# Altium project Motor Controller.PrjPcb
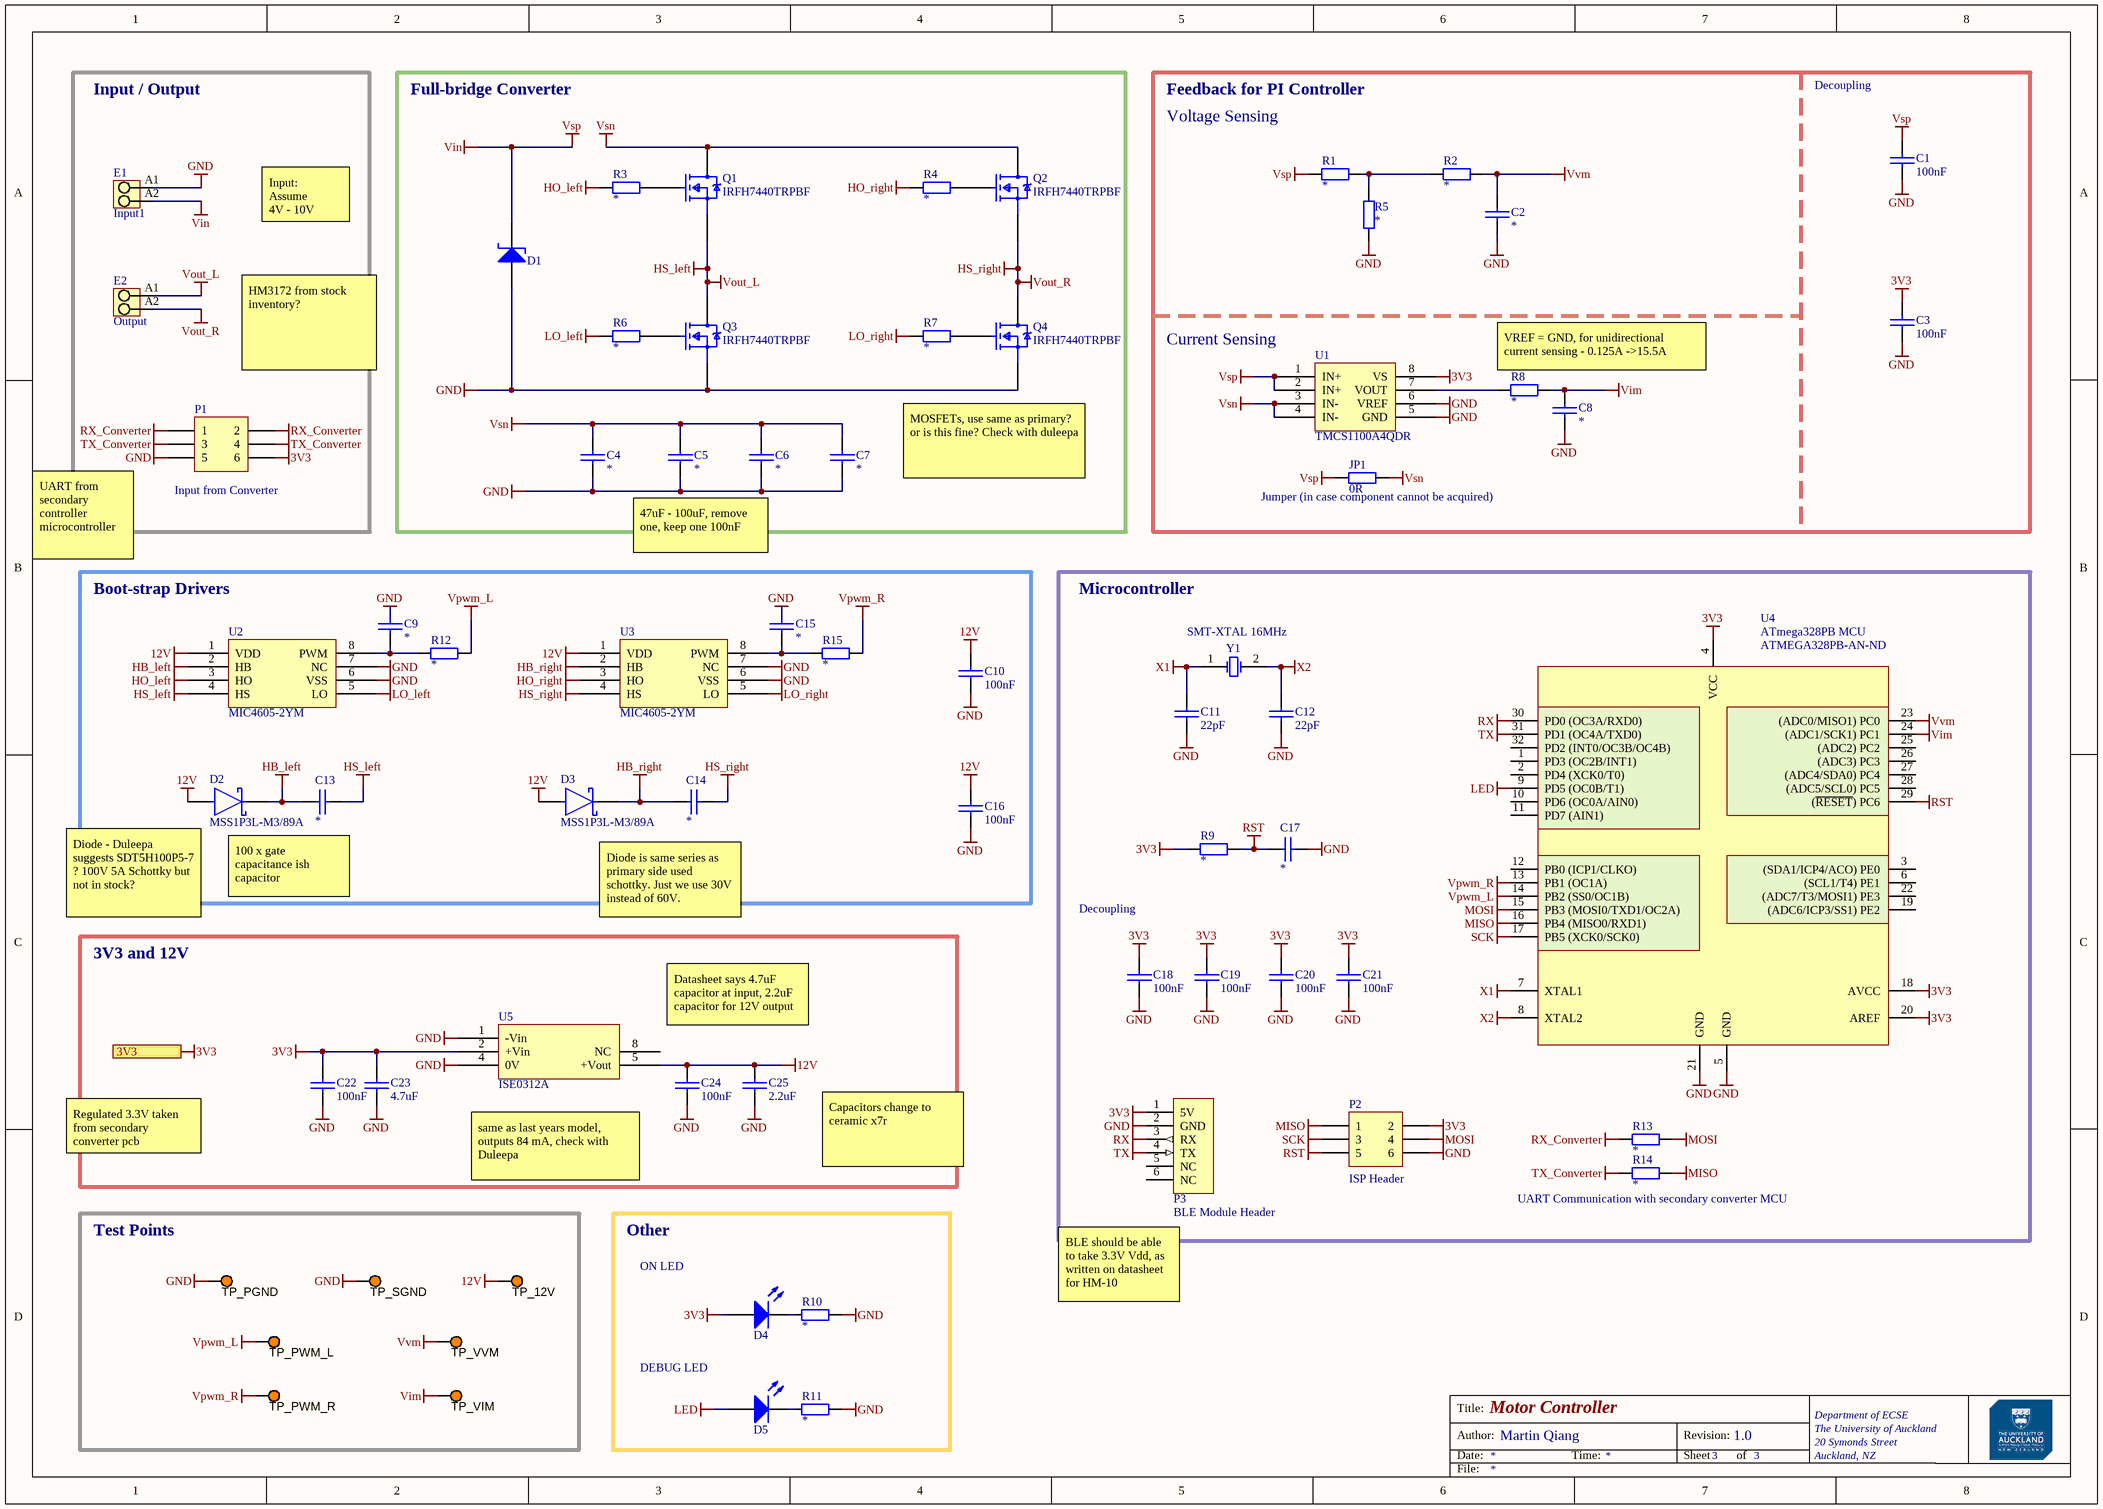
[diagram p0: MotorControllerV2.SchDoc]
1 sheet, 68 parts. Net scope: flat (ports and power ports of the same name join across sheets).
Board file: MotorControllerV1.PcbDoc

## Sheet MotorControllerV2.SchDoc: Motor Controller
size A3; Author: Martin Qiang; Address1: Department of ECSE; Address2: The University of Auckland; Address3: 20 Symonds Street; Address4: Auckland, NZ; Revision: 1.0; SheetNumber: 3; SheetTotal: 3

### Parts
C1  100nF  [0805 CAP]
C2  *  [0805 CAP]
C3  100nF  [0805 CAP]
C4  *  [0805 CAP]
C5  *  [0805 CAP]
C6  *  [0805 CAP]
C7  *  [0805 CAP]
C8  *  [0805 CAP]
C9  *  [0805 CAP]
C10  100nF  [0805 CAP]
C11  22pF  [0805 CAP]
C12  22pF  [0805 CAP]
C13  *  [0805 CAP]
C14  *  [0805 CAP]
C15  *  [0805 CAP]
C16  100nF  [0805 CAP]
C17  *  [0805 CAP]
C18  100nF  [0805 CAP]
C19  100nF  [0805 CAP]
C20  100nF  [0805 CAP]
C21  100nF  [0805 CAP]
C22  100nF  [0805 CAP]
C23  4.7uF  [0805 CAP]
C24  100nF  [0805 CAP]
C25  2.2uF  [0805 CAP]
D1  BZT52H-B4V7  [SOD123]  (value not drawn)
D2  MSS1P3L-M3/89A  [FP-96591-MFG]
D3  MSS1P3L-M3/89A  [FP-96591-MFG]
D4  LTST-C170KGKT  [0805 LED]  (value not drawn)
D5  LTST-C170KGKT  [0805 LED]  (value not drawn)
E1  Input1  [PM_5_08_90_02]
E2  Output  [PM_5_08_90_02]
JP1  0R  [Axial 0.1]
P1  Input from Converter  [HDR2X3]
P2  ISP Header  [HDR2X3]
P3  BLE Module Header  [HM10_HDR1X6]
Q1  IRFH7440TRPBF  [Infineon_PG-TDSON-8_MFG]
Q2  IRFH7440TRPBF  [Infineon_PG-TDSON-8_MFG]
Q3  IRFH7440TRPBF  [Infineon_PG-TDSON-8_MFG]
Q4  IRFH7440TRPBF  [Infineon_PG-TDSON-8_MFG]
R1  *  [0805 RES]
R2  *  [0805 RES]
R3  *  [0805 RES]
R4  *  [0805 RES]
R5  *  [0805 RES]
R6  *  [0805 RES]
R7  *  [0805 RES]
R8  *  [0805 RES]
R9  *  [0805 RES]
R10  *  [0805 RES]
R11  *  [0805 RES]
R12  *  [0805 RES]
R13  *  [0805 RES]
R14  *  [0805 RES]
R15  *  [0805 RES]
TP_12V  5003  [TP_TH]  (value not drawn)
TP_PGND  5003  [TP_TH]  (value not drawn)
TP_PWM_L  5003  [TP_TH]  (value not drawn)
TP_PWM_R  5003  [TP_TH]  (value not drawn)
TP_SGND  5003  [TP_TH]  (value not drawn)
TP_VIM  5003  [TP_TH]  (value not drawn)
TP_VVM  5003  [TP_TH]  (value not drawn)
U1  TMCS1100A4QDR  [SOIC8_D_TEX]
U2  MIC4605-2YM  [MIC4605-2YM]
U3  MIC4605-2YM  [MIC4605-2YM]
U4  ATmega328PB MCU  Supplier Part Number 1: ATMEGA328PB-AN-ND  [32 - TQFP]
U5  ISE0312A  [ISE0312A]
Y1  SMT-XTAL 16MHz  [HC49-US]

### Blocks framed on the sheet
Input / Output: E1 E2 P1
Full-bridge Converter: C4-C7 D1 Q1-Q4 R3 R4 R6 R7
Boot-strap Drivers: C9 C10 C13-C16 D2 D3 R12 R15 U2 U3
Microcontroller: C11 C12 C17-C21 P2 P3 R9 R13 R14 U4 Y1
3V3 and 12V: C22-C25 U5
Test Points: TP_12V TP_PGND TP_PWM_L TP_PWM_R TP_SGND TP_VIM TP_VVM
Other: D4 D5 R10 R11

### Ports
3V3 (in)

### Nets
3V3: C3.1 C18.1 C19.1 C20.1 C21.1 C22.1 C23.1 D4.1(A) P1.6 P2.2 P3.1(5V) R9.2 U1.8(VS) U4.4(VCC) U4.18(AVCC) U4.20(AREF) U5.2(+Vin) ; port 3V3
12V: C10.2 C16.2 C24.1 C25.1 D2.2(A) D3.2(A) TP_12V.1 U2.1(VDD) U3.1(VDD) U5.5(+Vout)
GND: C1.2 C2.2 C3.2 C4.1 C5.1 C6.1 C7.1 C8.2 C9.1 C10.1 C11.2 C12.2 C15.1 C16.1 C17.2 C18.2 C19.2 C20.2 C21.2 C22.2 C23.2 C24.2 C25.2 D1.1(A) E1.A1 P1.5 P2.6 P3.2(GND) Q3.1,2,3(S) Q4.1,2,3(S) R5.2 R10.1 R11.1 TP_PGND.1 TP_SGND.1 U1.5(GND) U1.6(VREF) U2.6(VSS) U2.7(NC) U3.6(VSS) U3.7(NC) U4.5(GND) U4.21(GND) U5.1(-Vin) U5.4(0V)
HB_left: C13.1 D2.1(C) U2.2(HB)
HB_right: C14.1 D3.1(C) U3.2(HB)
HO_left: R3.1 U2.3(HO)
HO_right: R4.1 U3.3(HO)
HS_left: C13.2 E2.A1 Q1.1,2,3(S) Q3.5,6,7,8(D) U2.4(HS)  [also labelled Vout_L]
HS_right: C14.2 E2.A2 Q2.1,2,3(S) Q4.5,6,7,8(D) U3.4(HS)  [also labelled Vout_R]
LED: D5.1(A) U4.9(PD5_(OC0B/T1))
LO_left: R6.2 U2.5(LO)
LO_right: R7.1 U3.5(LO)
MISO: P2.1 R14.1 U4.16(PB4_(MISO0/RXD1))
MOSI: P2.4 R13.1 U4.15(PB3_(MOSI0/TXD1/OC2A))
RST: C17.1 P2.5 R9.1 U4.29((~{RESET})_PC6)
RX: P3.3(RX) U4.30(PD0_(OC3A/RXD0))
RX_Converter: P1.1 P1.2 R13.2
SCK: P2.3 U4.17(PB5_(XCK0/SCK0))
TX: P3.4(TX) U4.31(PD1_(OC4A/TXD0))
TX_Converter: P1.3 P1.4 R14.2
Vim: C8.1 R8.2 TP_VIM.1 U4.24((ADC1/SCK1)_PC1)
Vin: C1.1 D1.2(K) E1.A2 JP1.1 R1.2 U1.1(IN+) U1.2(IN+)  [also labelled Vsp]
Vpwm_L: R12.2 TP_PWM_L.1 U4.14(PB2_(SS0/OC1B))
Vpwm_R: R15.2 TP_PWM_R.1 U4.13(PB1_(OC1A))
Vsn: C4.2 C5.2 C6.2 C7.2 JP1.2 Q1.5,6,7,8(D) Q2.5,6,7,8(D) U1.3(IN-) U1.4(IN-)
Vvm: C2.1 R2.2 TP_VVM.1 U4.23((ADC0/MISO1)_PC0)
X1: C11.1 U4.7(XTAL1) Y1.1(OSC1)
X2: C12.1 U4.8(XTAL2) Y1.2(OSC2)
NetC9_2: C9.2 R12.1 U2.8(PWM)
NetC15_2: C15.2 R15.1 U3.8(PWM)
NetD4_2: D4.2(K) R10.2
NetD5_2: D5.2(K) R11.2
NetQ1_4: Q1.4(G) R3.2
NetQ2_4: Q2.4(G) R4.2
NetQ3_4: Q3.4(G) R6.1
NetQ4_4: Q4.4(G) R7.2
NetR1_1: R1.1 R2.1 R5.1
NetR8_1: R8.1 U1.7(VOUT)

Not connected (* = marked no-connect by the designer): P3 5(NC) 6(NC); U4 1(PD3_(OC2B/INT1)) 2(PD4_(XCK0/T0)) 3((SDA1/ICP4/ACO)_PE0) 6((SCL1/T4)_PE1) 10(PD6_(OC0A/AIN0)) 11(PD7_(AIN1)) 12(PB0_(ICP1/CLKO)) 19((ADC6/ICP3/SS1)_PE2) 22((ADC7/T3/MOSI1)_PE3) 25((ADC2)_PC2) 26((ADC3)_PC3) 27((ADC4/SDA0)_PC4) 28((ADC5/SCL0)_PC5) 32(PD2_(INT0/OC3B/OC4B)); U5 8(NC)

### Notes on the sheet
- Feedback for PI Controller
- Decoupling
- Voltage Sensing
- Input:
  Assume
  4V - 10V
- HM3172 from stock inventory?
- (near U1) Current Sensing
- VREF = GND, for unidirectional current sensing - 0.125A ->15.5A
- MOSFETs, use same as primary? or is this fine? Check with duleepa
- (near JP1) Jumper (in case component cannot be acquired)
- UART from secondary controller microcontroller
- 47uF - 100uF, remove one, keep one 100nF
- (near D2) Diode - Duleepa suggests SDT5H100P5-7 ? 100V 5A Schottky but not in stock?
- 100 x gate capacitance ish capacitor
- Diode is same series as primary side used schottky. Just we use 30V instead of 60V.
- Datasheet says 4.7uF capacitor at input, 2.2uF capacitor for 12V output
- Regulated 3.3V taken from secondary converter pcb
- same as last years model, outputs 84 mA, check with Duleepa
- Capacitors change to ceramic x7r
- (near R14) UART Communication with secondary converter MCU
- ON LED
- (near P3) BLE should be able to take 3.3V Vdd, as written on datasheet for HM-10
- DEBUG LED
- Title:
- Author:
- Date:
- Time:
- Revision:
- Sheet
- of
- File:

### Library data of the parts
C1-C22 C24 = CerCap_SMT_0805: SMT ceramic capacitor 0805 size; Value: *
C23 = CerCap_SMT_0805: SMT ceramic capacitor 0805 size / x7r 4.7uF; Value: *
C25 = CerCap_SMT_0805: SMT ceramic capacitor 0805 size / x7r, 2.2uF; Value: *
D1 = Zener_SMT_SOD123: SMT zener diode with SOD123 package; Manufacturer: Nexperia USA Inc.; Manufacturer Part Number: BZT52H-B4V7,115; Tolerance: ±2%; Supplier 1: Digi-Key; RoHS: RoHS Compliant; Category: Discrete Semiconductor Products; Stock 1: 0; Pricing 1: 1=0.51, 10=0.408, 100=0.2164, 500=0.14232, 1000=0.09678 (NZD); Packaging: Cut Tape (CT); Part Status: Active; Operating Temperature: -65°C ~ 150°C (TA); Mounting Type: Surface Mount; Package / Case: SOD-123F; Supplier Device Package: SOD-123F; ComponentLink1URL: https://assets.nexperia.com/documents/data-sheet/BZT52H_SER.pdf; ComponentLink1Description: https://assets.nexperia.com/documents/data-sheet/BZT52H_SER.pdf; Supplier Part Number 1: 1727-1611-1-ND
D2 D3 = Diode_Schottky: DIODE SCHOTTKY 30V 1A MICROSMP / Rectifier Diode Schottky 30V 1A 2-Pin Micro SMP T/R; Manufacturer: Vishay; Max Junction Temp: +150°C; Max Surge Forward Current: 25A; Value: 65pF; Peak Reverse Current: 15uA; Forward Voltage: 500mV; Max Reverse Current: 250uA; Element Configuration: Single; Max Repetitive Reverse Voltage: 30V; Mouser Description: Schottky Diodes & Rectifiers 1.0 Amp 30 Volt; Device Class L2: Diodes; RoHS: TRUE; Temperature Range Low: -55°C; ComponentLink2URL: http://www.vishay.com/docs/89020/mss1p3l.pdf; Octopart: https://octopart.com/mss1p3l-m3%2F89a-vishay-42670898; Automotive: No; Height: 0.73mm; Temperature: -55°C to +150°C; Temperature Range High: +150°C; ComponentLink2Description: Datasheet; Lead Free: Yes; Digikey Description: DIODE SCHOTTKY 30V 1A MICROSMP; Forward Current: 1A; Manufacturer Part Number: MSS1P3L-M3/89A; Footprint Url: http://www.vishay.com/docs/96591/microsmp_do-219ad_fredpt.pdf; Device Class L1: Discrete Semiconductors; Capacitance: 65pF; Device Class L3: Schottky Diodes; Package: 96591; Category: Diode; Supplier 1: Digi-Key; Stock 1: 2503; Pricing 1: 1=0.30000, 10=0.24800, 100=0.13170, 500=0.08662, 1000=0.05890, 2000=0.05313 (USD); Mount: Surface Mount; Number of Pins: 2; Min Operating Temperature: -55°C; Max Operating Temperature: 150°C; Packaging: Tape and Reel; Max Surge Current: 25A; Package Quantity: 1; Average Rectified Current: 1A; Max Reverse Leakage Current: 250uA; Peak Non-Repetitive Surge Current: 25A; Max Repetitive Reverse Voltage (Vrrm): 30V; Max Forward Surge Current (Ifsm): 25A; Max Reverse Voltage (DC): 30V; Series: eSMP®; Length: 0.09inch; Width: 0.055inch; Radiation Hardening: No; REACH SVHC: Unknown; RoHS Compliant: Yes; ComponentLink1URL: https://datasheet.ciiva.com/23642/mss1p3l-23642464.pdf?src-supplier=Newark; ComponentLink1Description: https://datasheet.ciiva.com/23642/mss1p3l-23642464.pdf?src-supplier=Newark; ComponentLink3URL: https://datasheet.ciiva.com/917/mss1p3l-917251.pdf?src-supplier=Digi-Key; ComponentLink3Description: https://datasheet.ciiva.com/917/mss1p3l-917251.pdf?src-supplier=Digi-Key; ComponentLink4URL: https://datasheet.ciiva.com/917/mss1p3l-917252.pdf?src-supplier=Digi-Key; ComponentLink4Description: https://datasheet.ciiva.com/917/mss1p3l-917252.pdf?src-supplier=Digi-Key; ComponentLink5URL: https://datasheet.ciiva.com/917/mss1p3l-917253.pdf?src-supplier=Digi-Key; ComponentLink5Description: https://datasheet.ciiva.com/917/mss1p3l-917253.pdf?src-supplier=Digi-Key; ComponentLink6URL: https://datasheet.ciiva.com/8290/mss1p3l-8290391.pdf?src-supplier=Avnet; ComponentLink6Description: https://datasheet.ciiva.com/8290/mss1p3l-8290391.pdf?src-supplier=Avnet; ComponentLink7URL: https://datasheet.ciiva.com/16464/mss1p3l-16464118.pdf?src-supplier=Future+Electronics; ComponentLink7Description: https://datasheet.ciiva.com/16464/mss1p3l-16464118.pdf?src-supplier=Future+Electronics; ComponentLink8URL: https://datasheet.ciiva.com/7962/mss1p3l-7962344.pdf?src-supplier=Element14; ComponentLink8Description: https://datasheet.ciiva.com/7962/mss1p3l-7962344.pdf?src-supplier=Element14; ComponentLink9URL: https://datasheet.ciiva.com/25934/mss1p3l-25934805.pdf?src-supplier=Avnet+Europe; ComponentLink9Description: https://datasheet.ciiva.com/25934/mss1p3l-25934805.pdf?src-supplier=Avnet+Europe
D4 D5 = LED_SMT_0805: SMT LED 0805 size; Manufacturer: Lite-On Inc.; Color: Green; Lens Color: Colorless; Lens Transparency: Clear; Millicandela Rating: 35mcd; Lens Style/Size: Rectangle with Flat Top, 1.40mm x 1.25mm; Voltage - Forward (Vf) (Typ): 2V; Current - Test: 20mA; Viewing Angle: 130°; Wavelength - Dominant: 571nm; Wavelength - Peak: 574nm; Supplier 1: Digi-Key; Manufacturer Part Number: LTST-C170KGKT; RoHS: RoHS Compliant; Category: Optoelectronics; Stock 1: 503069; Pricing 1: 1=0.62, 10=0.459, 25=0.338, 100=0.2415, 250=0.16416, 500=0.14486, 1000=0.11347 (NZD); Packaging: Cut Tape (CT); Part Status: Active; Mounting Type: Surface Mount; Features: -; Package / Case: 0805 (2012 Metric); Size / Dimension: 2.00mm L x 1.25mm W; Height (Max): 1.10mm; ComponentLink1URL: http://optoelectronics.liteon.com/upload/download/DS22-2000-073/LTST-C170KGKT.pdf; ComponentLink1Description: http://optoelectronics.liteon.com/upload/download/DS22-2000-073/LTST-C170KGKT.pdf; Supplier Part Number 1: 160-1414-1-ND
E1 E2 = 2WayScrewTerminal_5.08mm: Conn Terminal Block 2 POS 5.08mm Solder ST Thru-Hole 15A Box; Manufacturer: Weidmueller; PartNumber: 1760490000; Contact_surface: tinned; Pitch_mm: 5,08 mm; Solid_min_H05_07_V_U: 0,13 mm²; Wire_cross_section_AWG_min_UL_1059: AWG 26; Wire_cross_section_AWG_max_UL_1059: AWG 14; Rated_voltage_for_surge_voltage_class_pollution_degree_II_2: 600 V; Mounting_onto_the_PCB: Solder connection; Solder_pin_length_mm: 3,5 mm; Side_termination_characteristic: closed side; Contact_material: Cu-Leg; Pitch_inch: 0,2 inch; No_of_poles: 2; UL_94_flammability_rating: V-0; Insulating_material: Wemid (PA); Rated_voltage_use_group_B_UL_1059: 300 V; Solid_max_H05_07_V_U: 2,5 mm²; Short_text_for_material: PM 5.08/02/90 3.5SN OR BX; Voltage Rating: 300V; Current Rating: 10A; Number of Levels: 1; Max Current Rating: 16A; Connector Type: PCB,Terminal Block; Pitch: 508mm; Wire Gauge (Max): 26AWG; Wire Gauge (Min): 14AWG; Hole Diameter: 1.3mm; Stripping Length: 6mm; Wire/Cable Gauge: 24AWG; Approvals: CSA,cURus; Revision: V1; Qty: 500 PCS; ComponentLink2Description: URL Link1; Packaging: Box; Rated_current_use_group_B_UL_1059: 15 A; PackageReference: PM_5_08_90_02; ComponentLink2URL: http://catalog.weidmueller.com/catalog/Start.do?localeId=en&ObjectID=1760490000; Colour: Orange; ComponentLink1Description: Manufacturer URL; ComponentLink1URL: http://www.weidmueller.com/; Supplier 1: Digi-Key; Manufacturer Part Number: 1760490000; RoHS: Yes; Category: Terminal Blocks; Stock 1: 2610; Pricing 1: 1=1.00000, 10=0.70300, 25=0.65560, 50=0.59500, 100=0.59230, 250=0.50016, 500=0.47384, 1000=0.42120, 5000=0.38025 (USD); Mount: Through Hole; Color: Orange; Contact Material: Copper Alloy; Housing Material: Thermoplastic; Contact Plating: Tin; Housing Color: Orange; Min Operating Temperature: -50°C; Max Operating Temperature: 120°C; Number of Poles: 2; Package Quantity: 500; Number of Rows: 1; Number of Positions Per Level: 2; Current: 15A; Voltage: 300V; Termination: Solder; Number of Contacts: 2; Number of Circuits: 2; Orientation: Straight; Series: PM; Number of Positions: 2; Max Supply Voltage: 300V; Length: 11.16mm; Width: 8mm; Depth: 8mm; Radiation Hardening: No; Flammability Rating: UL94 V-0; Lead Free: Lead Free; REACH SVHC: No SVHC; ComponentLink3URL: https://datasheet.ciiva.com/823/1760490000-823936.pdf?src-supplier=Digi-Key; ComponentLink3Description: https://datasheet.ciiva.com/823/1760490000-823936.pdf?src-supplier=Digi-Key; ComponentLink4URL: https://datasheet.ciiva.com/16046/1760490000-pm-5-08-02-90-3-5sn-or-bx-en-pdf-148-16046417.pdf?src-supplier=Onlinecomponents.com; ComponentLink4Description: https://datasheet.ciiva.com/16046/1760490000-pm-5-08-02-90-3-5sn-or-bx-en-pdf-148-16046417.pdf?src-supplier=Onlinecomponents.com
JP1 = Jumper
P1 P2 = Header 3X2: Header, 3-Pin, Dual row; LatestRevisionDate: 17-Jul-2002; LatestRevisionNote: Re-released for DXP Platform.; Publisher: Altium Limited
P3 = BLEModule_TH: 2.54mm pitch 6-pin header for BLE module; LatestRevisionDate: 17-Jul-2002; LatestRevisionNote: Re-released for DXP Platform.; Publisher: Altium Limited
Q1-Q4 = IRFH7440TRPBF: Single N-Channel 40 V 2.4 mOhm 92 nC HEXFET® Power Mosfet - PQFN 5 x 6 mm; Manufacturer: International Rectifier; Continuous Drain Current (ID): 85A; Rise Time: 45ns; Input Capacitance: 4.574nF; Max Power Dissipation: 104W; Rds On Max: 2.4mR; Fall Time: 42ns; Turn-Off Delay Time: 53ns; Drain to Source Voltage (Vdss): 40V; Turn-On Delay Time: 12ns; Threshold Voltage: 2.2V; Gate to Source Voltage (Vgs): 20V; Number of Elements: 1; Supplier 1: Newark; Manufacturer Part Number: IRFH7440TRPBF; RoHS: Yes; Category: MOSFETs; Mount: Surface Mount; Case/Package: QFN EP; Number of Pins: 8; Min Operating Temperature: -55°C; Max Operating Temperature: 150°C; Packaging: Tape and Reel; Package Quantity: 4000; Drain to Source Breakdown Voltage: 40V; Drain to Source Resistance: 2.4mR; Power Dissipation: 104W; On-State Resistance: 2.4MR; Series: StrongIRFET™; Drain-source On Resistance-Max: 2.4MR; Length: 5.85mm; Width: 5mm; Height: 1.17mm; Radiation Hardening: No; REACH SVHC: No SVHC; Lead Free: Lead Free; RoHS Compliant: Yes; ComponentLink1URL: https://datasheet.ciiva.com/30480/0900766b811ccaf7-30480025.pdf?src-supplier=RSComponents; ComponentLink1Description: https://datasheet.ciiva.com/30480/0900766b811ccaf7-30480025.pdf?src-supplier=RSComponents; ComponentLink2URL: https://datasheet.ciiva.com/16390/irfh7440pbf-16390391.pdf?src-supplier=Future+Electronics; ComponentLink2Description: https://datasheet.ciiva.com/16390/irfh7440pbf-16390391.pdf?src-supplier=Future+Electronics; ComponentLink3URL: https://datasheet.ciiva.com/6371/irfh7440pbf-6371293.pdf?src-supplier=Digi-Key; ComponentLink3Description: https://datasheet.ciiva.com/6371/irfh7440pbf-6371293.pdf?src-supplier=Digi-Key
R1-R15 = Res_SMT_0805: 0805 resistor; Published: 8-Jun-2000; LatestRevisionDate: 17-Jul-2002; LatestRevisionNote: Re-released for DXP Platform.; PackageReference: AXIAL-0.4; Publisher: Altium Limited; Value: *; ComponentLink1Description: https://nz.mouser.com/datasheet/2/315/AOA0000C304-1149620.pdf
TP_12V TP_PGND TP_PWM_L TP_PWM_R TP_SGND TP_VIM TP_VVM = TestPoint: Test Point, Orange, 1-Pin THD, RoHS; Peak Reverse Current: 600 uA; Forward Current: 3 A; Max Surge Current: 80 A; Forward Voltage: 1.08 V; Max Operating Temperature: 150 degC; PackageReference: 5003; Pins: 2; ComponentLink2URL: http://keyelco.com/userAssets/file/M65p56.pdf; PackageDescription: 1-Pin Through Hole Device, Dia 2.54 mm; Weight: 0.01 lb; Diameter: 5.3 mm; Mount: Through Hole; Package Quantity: 500; Packaging: Bulk; Min Operating Temperature: -65 degC; ComponentLink1Description: Manufacturer URL; Height: 0.25 inch; ComponentLink1URL: http://www.keyelco.com/; ComponentLink2Description: Datasheet; Width: 0.25 inch; REACH SVHC: No SVHC; RoHSCompliant: true; Radiation Hardening: No; Length: 9.5 mm; DatasheetVersion: Jun-15
U1 = TMCS1100A4QDR: Precision isolated current sensor with external reference 8-SOIC -40 to 125; Manufacturer: Texas Instruments; Supplier 1: Digi-Key; Manufacturer Part Number: TMCS1100A4QDR; RoHS: Yes; Category: Integrated Circuits (ICs); Stock 1: 2103; Pricing 1: 1=4.42000, 10=3.97300, 25=3.75640, 100=3.25550, 250=3.08856, 500=2.77136, 1000=2.75625 (USD)
U2 U3 = MIC4605-2YM: Driver 1A 2-OUT High and Low Side Half Brdg Non-Inv 8-Pin SOIC N Tube; Manufacturer: Microchip; Manufacturer Part Number: MIC4605-2YM-T5; Number of Drivers: 2; Max Supply Voltage: 16V; Min Supply Voltage: 5.5V; Number of Outputs: 1; Rise Time: 20ns; Nominal Supply Current: 135uA; Output Voltage: 1.9V; Element Configuration: Single; Propagation Delay: 35ns; Channel Type: Independent; Supplier 1: Digi-Key; RoHS: Yes; Category: Gate Drivers; Pricing 1: 1=1.39000 (USD); Mount: Surface Mount; Case/Package: SOIC; Number of Pins: 8; Min Operating Temperature: -40°C; Max Operating Temperature: 125°C; Packaging: Tape and Reel; Package Quantity: 500; Max Output Current: 1A; Fall Time: 20ns; Length: 4.93mm; Width: 3.94mm; Height: 1.63mm; Radiation Hardening: No; RoHS Compliant: Yes; Lead Free: Lead Free; ComponentLink1URL: https://datasheet.ciiva.com/26948/getdatasheetpartid-789737-26948139.pdf?src-supplier=Verical; ComponentLink1Description: https://datasheet.ciiva.com/26948/getdatasheetpartid-789737-26948139.pdf?src-supplier=Verical; Supplier 2: Digi-Key; Stock 2: 88; Pricing 2: 1=0.95000, 25=0.78440, 100=0.72080 (USD); REACH SVHC: No SVHC; ComponentLink2URL: https://datasheet.ciiva.com/28655/1785059-28655117.pdf?src-supplier=Element14; ComponentLink2Description: https://datasheet.ciiva.com/28655/1785059-28655117.pdf?src-supplier=Element14
U4 = ATmega328PB_SMT_TQFP32: IC MCU 8BIT 32KB FLASH 32TQFP; Manufacturer: Atmel; Manufacturer Part Number: ATMEGA328PB-AN; Core Processor: AVR; Core Size: 8-Bit; Speed: 20MHz; Connectivity: I²C, SPI, UART/USART; Peripherals: Brown-out Detect/Reset, POR, PWM, WDT; Number of I/O: 27; Program Memory Size: 32KB (16K x 16); EEPROM Size: 1K x 8; RAM Size: 2K x 8; Voltage - Supply (Vcc/Vdd): 1.8 V ~ 5.5 V; Data Converters: A/D 8x10b; Oscillator Type: Internal; Supplier 1: Digi-Key; RoHS: RoHS Compliant; Category: Integrated Circuits (ICs); Stock 1: 366; Pricing 1: 1=2.74, 10=2.448, 25=2.2032, 100=2.0074, 250=1.81152, 500=1.62548, 1000=1.37088 (USD); Packaging: Tray; Part Status: Active; Program Memory Type: FLASH; Operating Temperature: -40°C ~ 105°C (TA); Package / Case: 32-TQFP; Supplier Device Package: 32-TQFP (7x7); ComponentLink1URL: http://www.atmel.com/images/atmel-42397-8-bit-avr-microcontroller-atmega328pb_datasheet.pdf; ComponentLink1Description: http://www.atmel.com/images/atmel-42397-8-bit-avr-microcontroller-atmega328pb_datasheet.pdf
U5 = ISE0312A: 3V - 12V Dc-dc Converter, 1W Sdm, Single O/p, Unreg; Manufacturer: XP Power; Number of Outputs: 1; Min Input Voltage: 2.97V; Max Input Voltage: 3.63V; Max Output Current: 84mA; Isolation Voltage: 1.5kV; Efficiency: 80%; Supplier 1: Digi-Key; Manufacturer Part Number: ISE0312A; RoHS: Yes; Category: Board Mount Modules; Stock 1: 1649; Pricing 1: 1=4.29000, 5=4.16400, 10=4.03500, 25=3.86320, 100=3.61200 (USD); Mount: Surface Mount,PCB; Case/Package: SMD/SMT; Min Operating Temperature: -40°C; Max Operating Temperature: 105°C; Packaging: Rail/Tube; Voltage - Output 1: 12V; Max Power Dissipation: 1W; Features: SCP; Min Input Voltage (DC): 2.97V; Max Input Voltage (DC): 3.63V; Max Output Power: 1W; Current - Output 1: 84mA; Output Power: 1W; Length: 0.5inch; Width: 0.44inch; Height: 0.29inch; Depth: 12.7mm; REACH SVHC: Unknown; RoHS Compliant: Yes; ComponentLink1URL: http://www.farnell.com/datasheets/2334158.pdf?src-supplier=Farnell; ComponentLink1Description: http://www.farnell.com/datasheets/2334158.pdf?src-supplier=Farnell; ComponentLink2URL: http://www.alliedelec.com/m/d/c82960fec94d011cb1647333c66d561d.pdf?src-supplier=Allied+Electronics; ComponentLink2Description: http://www.alliedelec.com/m/d/c82960fec94d011cb1647333c66d561d.pdf?src-supplier=Allied+Electronics; ComponentLink3URL: https://www.xppower.com/Portals/0/pdfs/SF_ISE.pdf?src-supplier=Digi-Key; ComponentLink3Description: https://www.xppower.com/Portals/0/pdfs/SF_ISE.pdf?src-supplier=Digi-Key; ComponentLink4URL: http://www.farnell.com/datasheets/1903566.pdf?src-supplier=Element14; ComponentLink4Description: http://www.farnell.com/datasheets/1903566.pdf?src-supplier=Element14; ComponentLink5URL: http://www.farnell.com/datasheets/2334158.pdf?src-supplier=Newark; ComponentLink5Description: http://www.farnell.com/datasheets/2334158.pdf?src-supplier=Newark
Y1 = TXC9C-16_XTAL_SMT: 9C-16.000MAAJ-T crystal 16.0000MHZ 18PF SMD; Manufacturer: TXC CORPORATION; Frequency Stability: ±30ppm; Operating Mode: Fundamental; Supplier 1: Digi-Key; Manufacturer Part Number: 9C-16.000MAAJ-T; RoHS: RoHS Compliant; Category: Crystals, Oscillators, Resonators; Stock 1: 11514; Pricing 1: 1=0.75, 10=0.628, 50=0.5656, 100=0.5026, 500=0.47744 (NZD); Packaging: Cut Tape (CT); Part Status: Active; Type: MHz Crystal; Frequency Tolerance: ±30ppm; Load Capacitance: 18pF; Operating Temperature: -20°C ~ 70°C; Ratings: -; Mounting Type: Surface Mount; Package / Case: HC-49/US; Size / Dimension: 0.449" L x 0.189" W (11.40mm x 4.80mm); Height - Seated (Max): 0.161" (4.10mm); ComponentLink1URL: http://www.txccorp.com/download/products/quartz_crystals/2015TXC_9C_32.pdf; ComponentLink1Description: http://www.txccorp.com/download/products/quartz_crystals/2015TXC_9C_32.pdf; Supplier Part Number 1: 887-1059-1-ND